# EAGLE schematic dimmer3 (EAGLE 7.6.0)
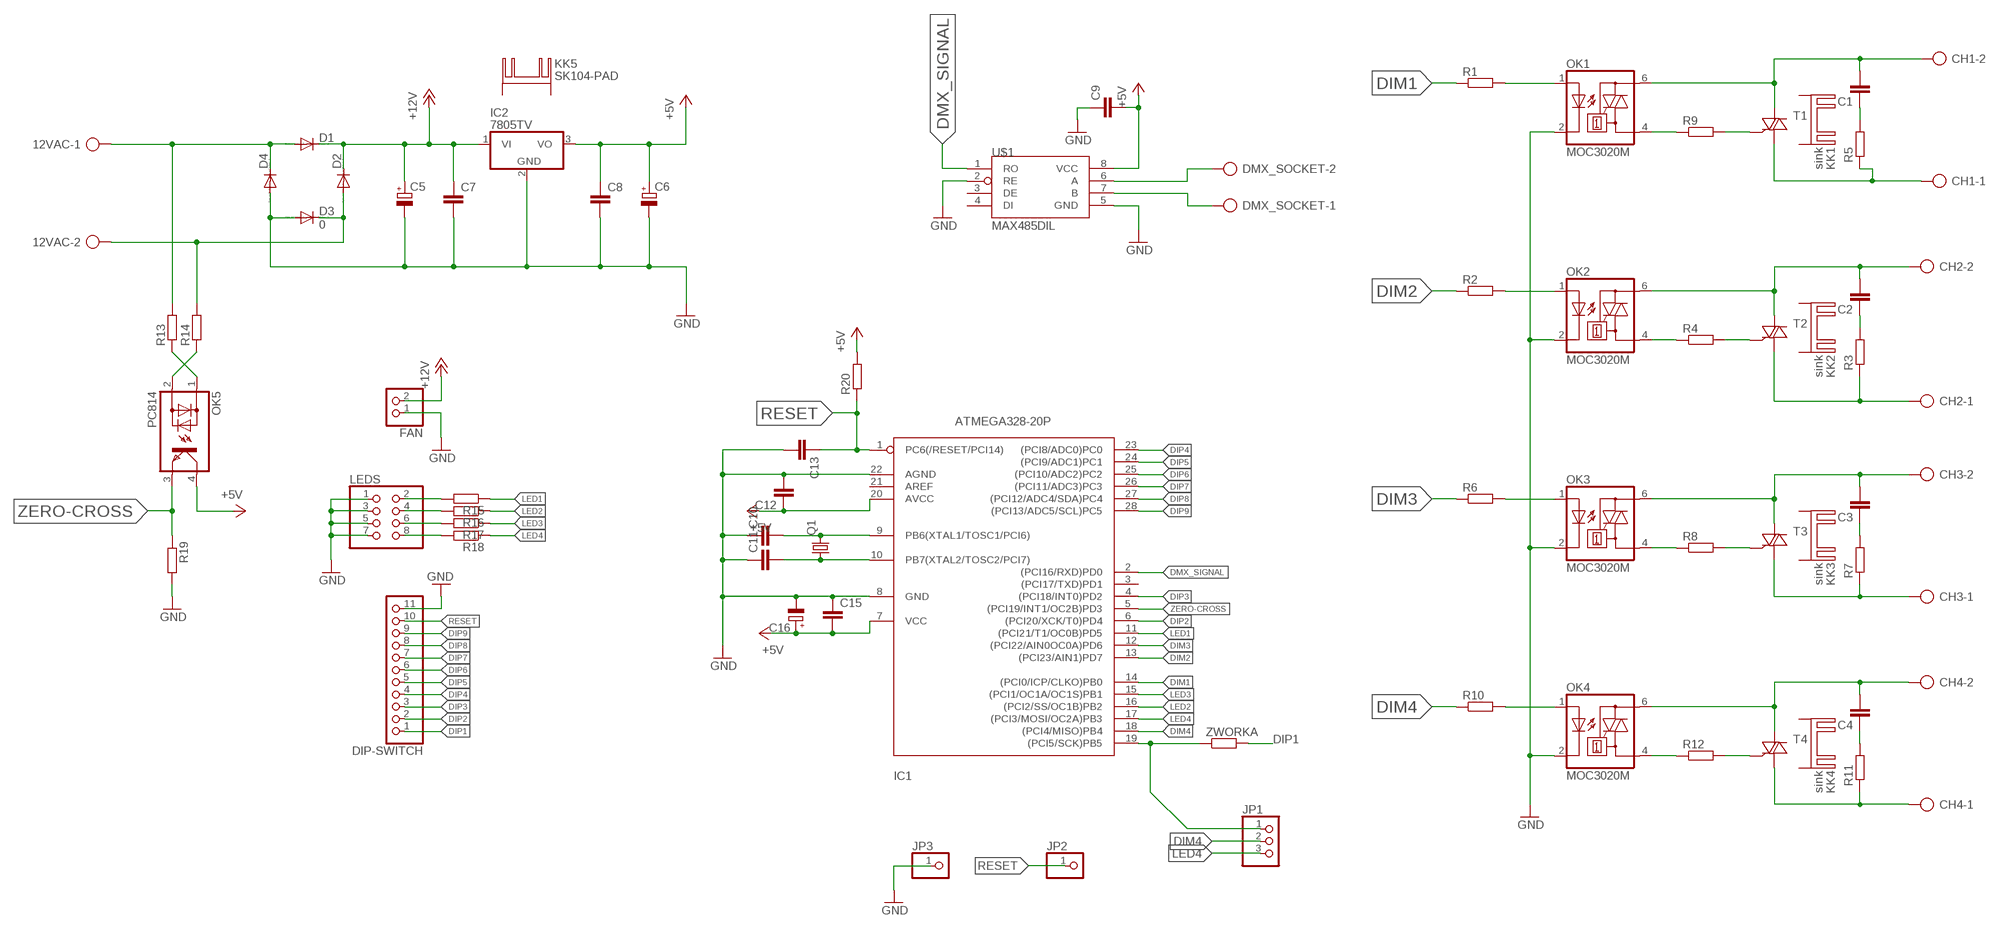
[diagram p0: schematic, sheet 1]

## Parts
12VAC  AK500/2  [AK500/2]
C1  C-EU102-054X133  [C102-054X133]
C2  C-EU102-054X133  [C102-054X133]
C3  C-EU102-054X133  [C102-054X133]
C4  C-EU102-054X133  [C102-054X133]
C5  CPOL-EUE5-13  [E5-13]
C6  CPOL-EUE2.5-7  [E2,5-7]
C7  C-EU050-024X044  [C050-024X044]
C8  C-EU050-024X044  [C050-024X044]
C9  C-EU050-024X044  [C050-024X044]
C10  C-EU050-024X044  [C050-024X044]
C11  C-EU050-024X044  [C050-024X044]
C12  C-EU050-024X044  [C050-024X044]
C13  C-EU050-024X044  [C050-024X044]
C15  C-EU050-024X044  [C050-024X044]
C16  CPOL-EUE2,5-6E  [E2,5-6E]
CH1  AK500/2  [AK500/2]
CH2  AK500/2  [AK500/2]
CH3  AK500/2  [AK500/2]
CH4  AK500/2  [AK500/2]
D1  1N4004  [DO41-10]
D2  1N4004  [DO41-10]
D3  0  1N4004  [DO41-10]
D4  1N4004  [DO41-10]
DIP-SWITCH  PINHD-1X11  [1X11]
DMX_SOCKET  AK500/2  [AK500/2]
FAN  PINHD-1X2  [1X02]
IC1  ATMEGA328-20P  [DIL28-3]
IC2  7805TV  [TO220V]
JP1  PINHD-1X3  [1X03]
JP2  PINHD-1X1  [1X01]
JP3  PINHD-1X1  [1X01]
KK1  sink  SK104-PAD  [SK104-PAD]
KK2  sink  SK104-PAD  [SK104-PAD]
KK3  sink  SK104-PAD  [SK104-PAD]
KK4  sink  SK104-PAD  [SK104-PAD]
KK5  SK104-PAD  [SK104-PAD]
LEDS  PINHD-2X4  [2X04]
OK1  MOC3020M  [DIL06]
OK2  MOC3020M  [DIL06]
OK3  MOC3020M  [DIL06]
OK4  MOC3020M  [DIL06]
OK5  PC814  [DIL04]
Q1  CRYSTALHC49U-V  [HC49U-V]
R1  R-EU_0207/10  [0207/10]
R2  R-EU_0207/10  [0207/10]
R3  R-EU_0617/22  [0617/22]
R4  R-EU_0207/10  [0207/10]
R5  R-EU_0617/22  [0617/22]
R6  R-EU_0207/10  [0207/10]
R7  R-EU_0617/22  [0617/22]
R8  R-EU_0207/10  [0207/10]
R9  R-EU_0207/10  [0207/10]
R10  R-EU_0207/10  [0207/10]
R11  R-EU_0617/22  [0617/22]
R12  R-EU_0207/10  [0207/10]
R13  R-EU_0207/10  [0207/10]
R14  R-EU_0207/10  [0207/10]
R15  R-EU_0207/10  [0207/10]
R16  R-EU_0207/10  [0207/10]
R17  R-EU_0207/10  [0207/10]
R18  R-EU_0207/10  [0207/10]
R19  R-EU_0207/10  [0207/10]
R20  R-EU_0207/10  [0207/10]
T1  BT138-DSH  [TO220DSH]
T2  BT138-DSH  [TO220DSH]
T3  BT138-DSH  [TO220DSH]
T4  BT138-DSH  [TO220DSH]
U$1  MAX485DIL  [DIL08]
ZWORKA  R-EU_0204/7  [0204/7]

## Nets
+5V: C6.+ C8.1 C9.2 C12.1 C15.2 C16.+ IC1.7(VCC) IC1.20(AVCC) IC2.3(VO) OK5.4(C) R20.2 U$1.8(VCC)
+12V: C5.+ C7.1 D1.C D2.C FAN.2 IC2.1(VI)
DIM1: IC1.14((PCI0/ICP/CLKO)PB0) R1.1
DIM2: IC1.13((PCI23/AIN1)PD7) R2.1
DIM3: IC1.12((PCI22/AIN0OC0A)PD6) R6.1
DIM4: IC1.18((PCI4/MISO)PB4) JP1.2 R10.1
DIP1: DIP-SWITCH.1 ZWORKA.2
DIP2: DIP-SWITCH.2 IC1.6((PCI20/XCK/T0)PD4)
DIP3: DIP-SWITCH.3 IC1.4((PCI18/INT0)PD2)
DIP4: DIP-SWITCH.4 IC1.23((PCI8/ADC0)PC0)
DIP5: DIP-SWITCH.5 IC1.24((PCI9/ADC1)PC1)
DIP6: DIP-SWITCH.6 IC1.25((PCI10/ADC2)PC2)
DIP7: DIP-SWITCH.7 IC1.26((PCI11/ADC3)PC3)
DIP8: DIP-SWITCH.8 IC1.27((PCI12/ADC4/SDA)PC4)
DIP9: DIP-SWITCH.9 IC1.28((PCI13/ADC5/SCL)PC5)
DMX_SIGNAL: IC1.2((PCI16/RXD)PD0) U$1.1(RO)
GND: C5.- C6.- C7.2 C8.2 C9.1 C10.1 C11.1 C12.2 C13.2 C15.1 C16.- D3.A D4.A DIP-SWITCH.11 FAN.1 IC1.8(GND) IC1.22(AGND) IC2.2(GND) JP3.1 LEDS.1 LEDS.3 LEDS.5 LEDS.7 OK1.2(C) OK2.2(C) OK3.2(C) OK4.2(C) R19.2 U$1.2(RE) U$1.5(GND)
LED1: IC1.11((PCI21/T1/OC0B)PD5) R15.1
LED2: IC1.16((PCI2/SS/OC1B)PB2) R16.1
LED3: IC1.15((PCI1/OC1A/OC1S)PB1) R17.1
LED4: IC1.17((PCI3/MOSI/OC2A)PB3) JP1.3 R18.1
N$1: C1.2 CH1.2 OK1.6(A2) T1.A2
N$2: CH1.1 R5.1 T1.A1
N$3: C3.1 R7.2
N$4: CH4.1 R11.1 T4.A1
N$5: C2.2 CH2.2 OK2.6(A2) T2.A2
N$6: R9.2 T1.G
N$7: OK1.4(A1) R9.1
N$8: OK1.1(A) R1.2
N$9: CH2.1 R3.1 T2.A1
N$10: C4.1 R11.2
N$11: C2.1 R3.2
N$12: R4.2 T2.G
N$13: OK2.4(A1) R4.1
N$14: OK2.1(A) R2.2
N$15: C3.2 CH3.2 OK3.6(A2) T3.A2
N$16: CH3.1 R7.1 T3.A1
N$17: C1.1 R5.2
N$18: OK5.1(AC1) R13.1
N$19: R8.2 T3.G
N$20: OK3.4(A1) R8.1
N$21: OK3.1(A) R6.2
N$22: C4.2 CH4.2 OK4.6(A2) T4.A2
N$23: OK5.2(AC2) R14.1
N$26: R12.2 T4.G
N$27: OK4.4(A1) R12.1
N$28: OK4.1(A) R10.2
N$29: LEDS.2 R15.2
N$31: 12VAC.1 D1.A D4.C R13.2
N$32: LEDS.4 R16.2
N$33: 12VAC.2 D2.A D3.C R14.2
N$34: LEDS.6 R17.2
N$36: LEDS.8 R18.2
N$37: DMX_SOCKET.2 U$1.6(A)
N$38: DMX_SOCKET.1 U$1.7(B)
N$39: C10.2 IC1.9(PB6(XTAL1/TOSC1/PCI6)) Q1.2
N$40: C11.2 IC1.10(PB7(XTAL2/TOSC2/PCI7)) Q1.1
RESET: C13.1 DIP-SWITCH.10 IC1.1(PC6(/RESET/PCI14)) JP2.1 R20.1
XDDD: IC1.19((PCI5/SCK)PB5) JP1.1 ZWORKA.1
ZERO-CROSS: IC1.5((PCI19/INT1/OC2B)PD3) OK5.3(E) R19.1
Unconnected: IC1.3((PCI17/TXD)PD1) IC1.21(AREF) KK1.K1(K) KK1.K2(K) KK2.K1(K) KK2.K2(K) KK3.K1(K) KK3.K2(K) KK4.K1(K) KK4.K2(K) KK5.K1(K) KK5.K2(K) U$1.3(DE) U$1.4(DI)

## Library data of the parts
12VAC CH1-CH4 DMX_SOCKET = con-ptr500:AK500/2: CONNECTOR; OC_FARNELL: unknown; OC_NEWARK: unknown
C1-C4 C7-C13 C15 = rcl:C-EU: CAPACITOR, European symbol
C5 C6 C16 = rcl:CPOL-EU: POLARIZED CAPACITOR, European symbol
D1-D4 = diode:1N4004: DIODE general purpose rectifier, 1 A
DIP-SWITCH = pinhead:PINHD-1X11: PIN HEADER
FAN = pinhead:PINHD-1X2: PIN HEADER
IC1 = atmega328:ATMEGA328*P: MICROCONTROLLER 32 kBytes FLASH 2 kBytes SRAM 1 kBytes EEPROM USART 8-channel 10 bit ADC
IC2 = linear:78*: Positive VOLTAGE REGULATOR Source: http://cache.national.com/ds/LM/LM78L05.pdf http://www.fairchildsemi.com/ds/LM/LM7805.pdf
JP1 = pinhead:PINHD-1X3: PIN HEADER
JP2 JP3 = pinhead:PINHD-1X1: PIN HEADER
KK1-KK5 = heatsink:SK104-PAD: HEATSINK manufacturer Fischer/distributor Buerklin
LEDS = pinhead:PINHD-2X4: PIN HEADER
OK1-OK4 = optocoupler:MOC30*M: RANDOM-PHASE OPTOISOLATORS TRIAC DRIVER OUTPUT Source: http://www.fairchildsemi.com MOC3020-M.pdf; MF: FAIRCHILD SEMICONDUCTOR; MPN: MOC3020-M; OC_FARNELL: 1505425; OC_NEWARK: 72K8895
OK5 = optocoupler:PC814: SHARP OPTO COUPLER; OC_FARNELL: 9707662; OC_NEWARK: unknown
Q1 = crystal:CRYSTAL: CRYSTAL; OC_FARNELL: 1666969; OC_NEWARK: unknown
R1-R20 ZWORKA = rcl:R-EU_: RESISTOR, European symbol
T1-T4 = triac:BT138: TRIAC Source: http://www.semiconductors.philips.com BT138_SERIES_2.pdf
U$1 = MAXIM:MAX485